# EAGLE design spinner (EAGLE 8.1.1)
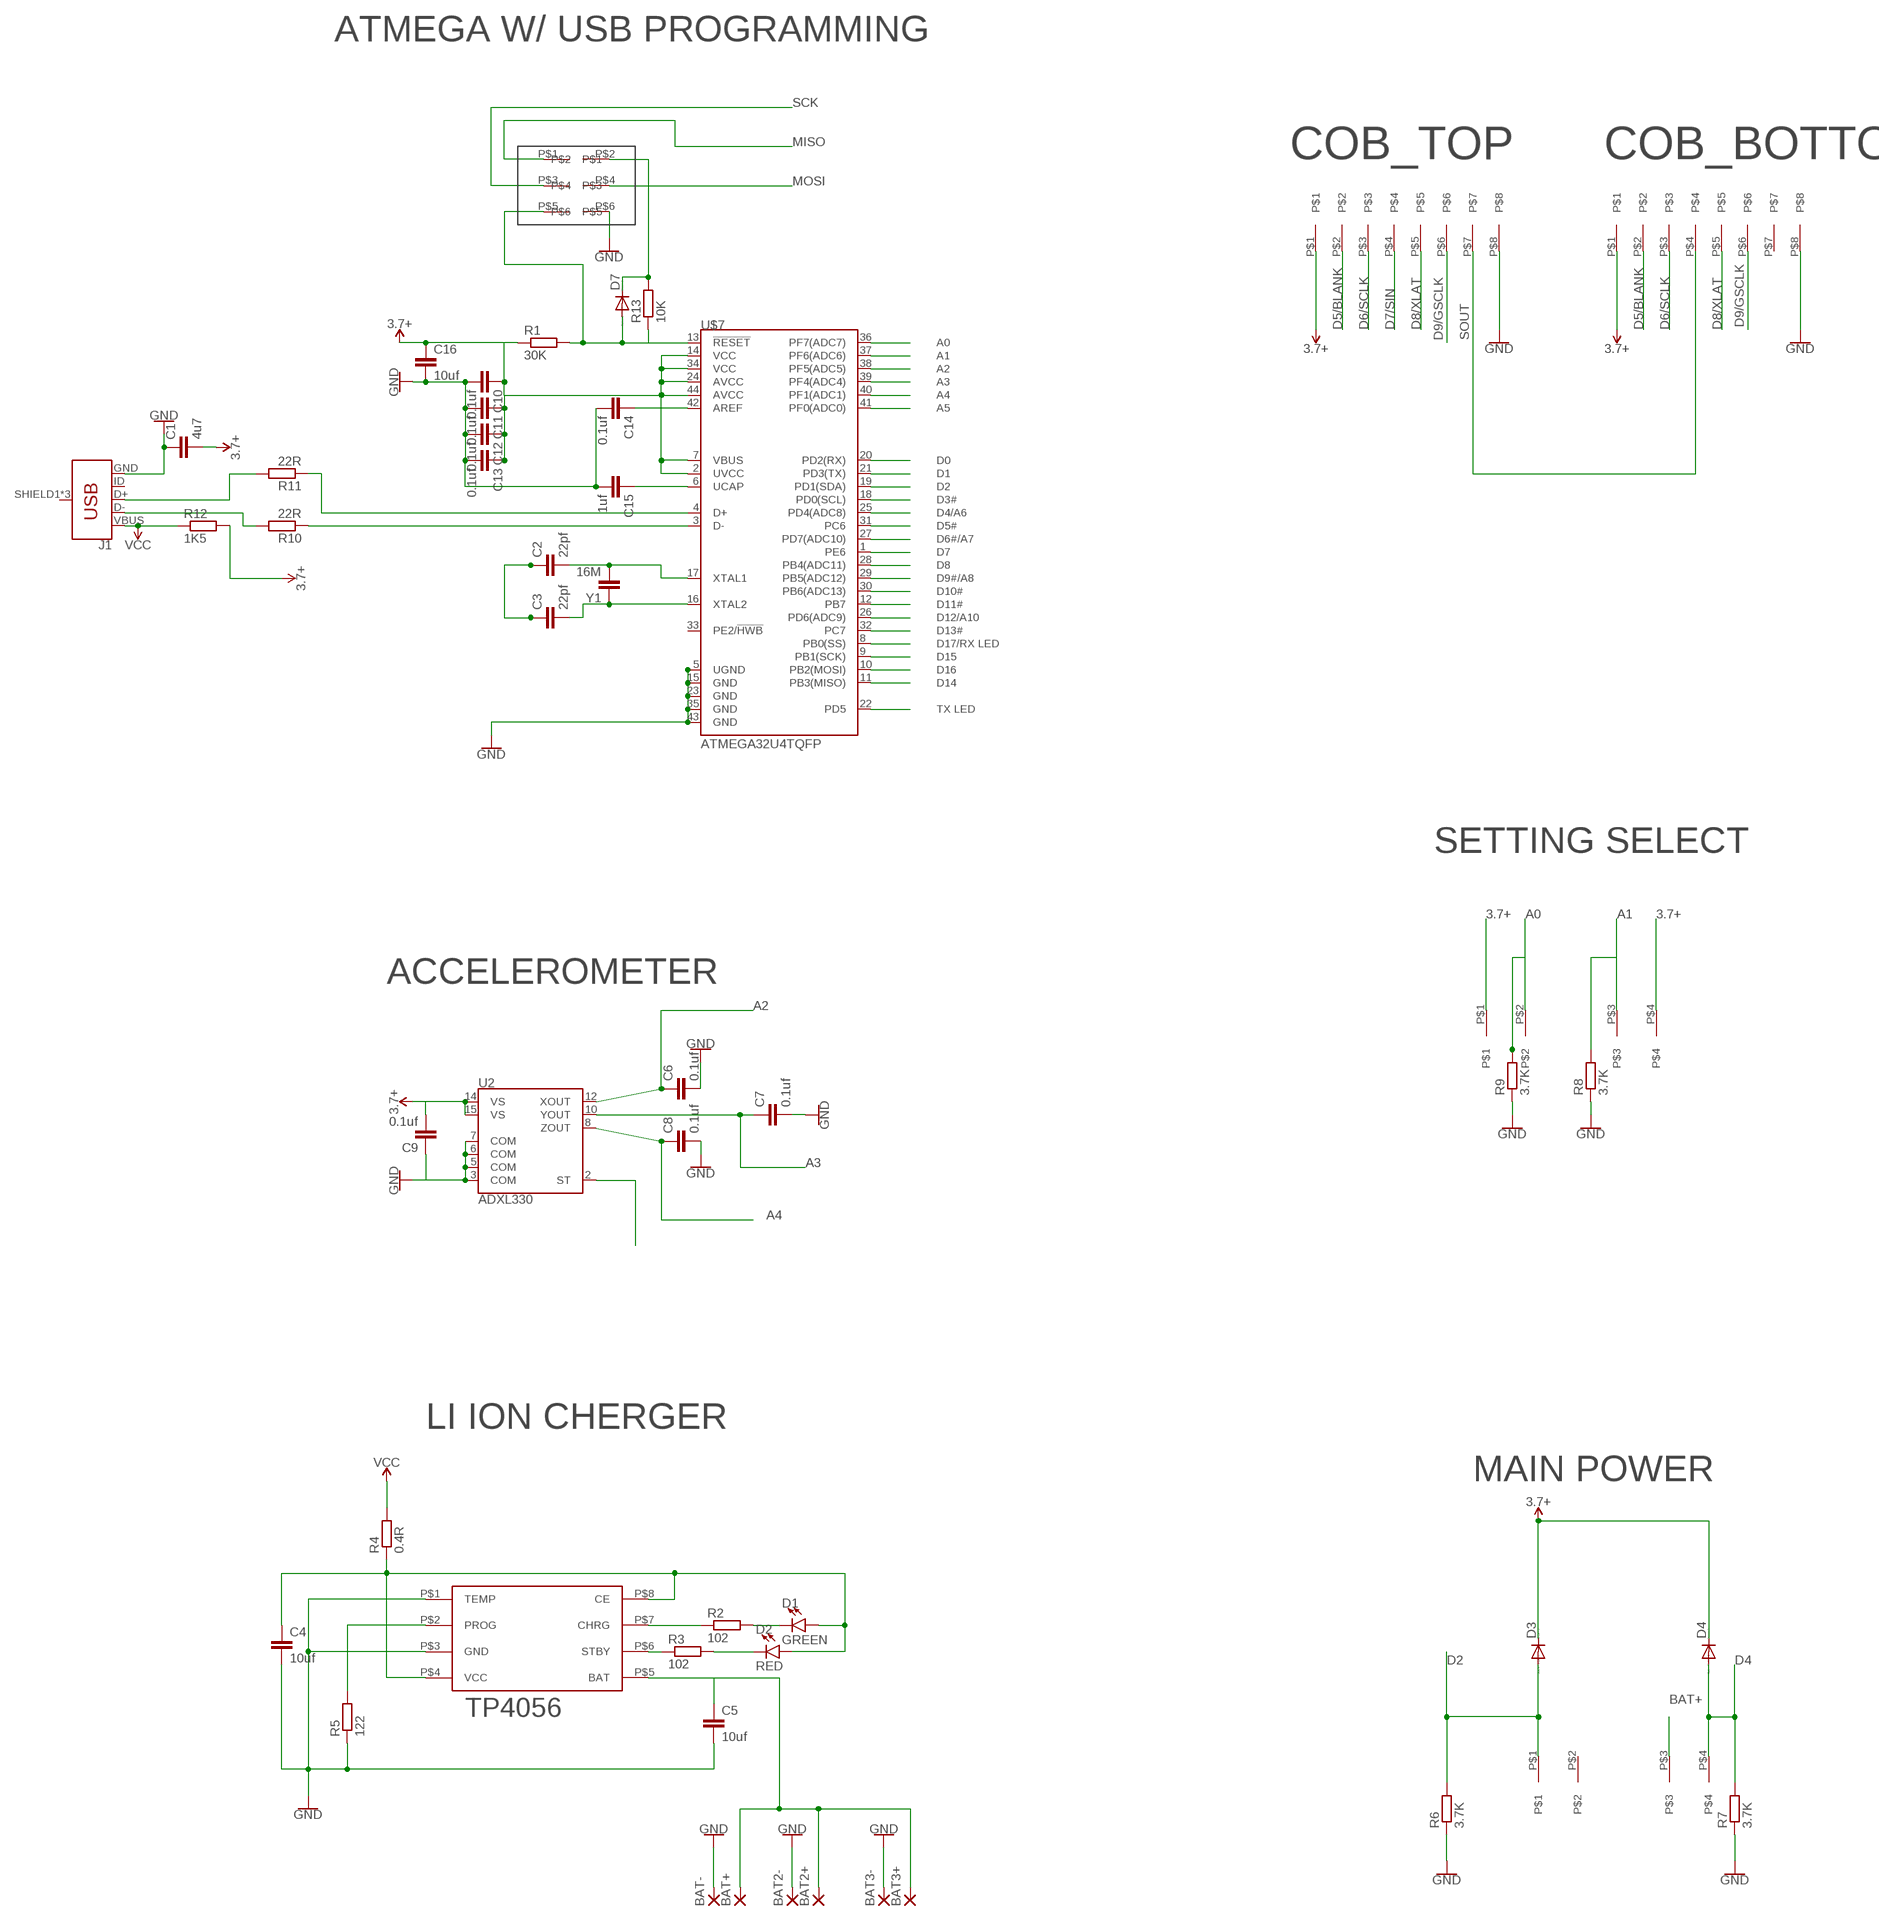
[diagram p0: schematic, sheet 1]

## Parts
BAT2+  SMD2  [SMD1,27-2,54]
BAT2-  SMD2  [SMD1,27-2,54]
BAT3+  SMD2  [SMD1,27-2,54]
BAT3-  SMD2  [SMD1,27-2,54]
BAT+  SMD2  [SMD1,27-2,54]
BAT-  SMD2  [SMD1,27-2,54]
C1  4u7  C-EUC0603  [C0603]
C2  22pf  C-EUC0603  [C0603]
C3  22pf  C-EUC0603  [C0603]
C4  10uf  C-EUC0603  [C0603]
C5  10uf  C-EUC0603  [C0603]
C6  0.1uf  C-EUC0603  [C0603]
C7  0.1uf  C-EUC0603  [C0603]
C8  0.1uf  C-EUC0603  [C0603]
C9  0.1uf  C-EUC0603  [C0603]
C10  0.1uf  C-EUC0603  [C0603]
C11  0.1uf  C-EUC0603  [C0603]
C12  0.1uf  C-EUC0603  [C0603]
C13  0.1uf  C-EUC0603  [C0603]
C14  0.1uf  C-EUC0603  [C0603]
C15  1uf  C-EUC0603  [C0603]
C16  10uf  C-EUC0603  [C0603]
D1  GREEN  LED-GREEN0603  [LED-0603]
D2  RED  LED-RED0603  [LED-0603]
D3  DIODE-SOD123  [SOD123]
D4  DIODE-SOD123  [SOD123]
D7  DIODE-SOD123  [SOD123]
J1  USB_MICRO-BREDUCED_PASTE  [USB-B-MICRO-SMD_RED_PASTE]
R1  30K  R-EU_R0603  [R0603]
R2  102  R-EU_R0603  [R0603]
R3  102  R-EU_R0603  [R0603]
R4  0.4R  R-EU_R0603  [R0603]
R5  122  R-EU_R0603  [R0603]
R6  3.7K  R-EU_R0603  [R0603]
R7  3.7K  R-EU_R0603  [R0603]
R8  3.7K  R-EU_R0603  [R0603]
R9  3.7K  R-EU_R0603  [R0603]
R10  22R  R-EU_R0603  [R0603]
R11  22R  R-EU_R0603  [R0603]
R12  1K5  R-EU_R0603  [R0603]
R13  10K  R-EU_R0603  [R0603]
U2  ADXL330  [LFCSP-16-4X4]
U$1  SLIDE_SWITCH  [SLIDE_SWITCH]
U$2  SLIDE_SWITCH  [SLIDE_SWITCH]
U$3  TP4056  [TP4056]
U$6  ICSP  [ICSP]
U$7  ATMEGA32U4TQFP  [SPARKFUN-DIGITALIC_TQFP44]
U$8  8PIN  [8PIN]
U$9  8PIN  [8PIN]
Y1  16M  C-EUC0603  [C0603]

## Nets
3.7+: C1.2 C9.2 C10.1 C11.1 C12.1 C13.1 C16.1 D3.C D4.C R1.1 R12.2 U2.14(VS) U2.15(VS) U$1.P$1 U$1.P$4 U$7.2(UVCC) U$7.7(VBUS) U$7.14(VCC) U$7.24(AVCC) U$7.34(VCC) U$7.44(AVCC) U$8.P$1 U$9.P$1
A0: R9.2 U$1.P$2 U$7.36(PF7(ADC7))
A1: R8.2 U$1.P$3 U$7.37(PF6(ADC6))
A2: C6.1 U2.12(XOUT) U$7.38(PF5(ADC5))
A3: C7.1 U2.10(YOUT) U$7.39(PF4(ADC4))
A4: C8.1 U2.8(ZOUT) U$7.40(PF1(ADC1))
A5: U$7.41(PF0(ADC0))
BAT+: BAT2+.1(P) BAT3+.1(P) BAT+.1(P) C5.1 U$2.P$3 U$3.P$5(BAT)
D0: U$7.20(PD2(RX))
D1: U$7.21(PD3(TX))
D2: D3.A R6.2 U$2.P$1 U$7.19(PD1(SDA))
D3: U$7.18(PD0(SCL))
D4: D4.A R7.2 U$2.P$4 U$7.25(PD4(ADC8))
D5/BLANK: U$7.31(PC6) U$8.P$2 U$9.P$2
D6/SCLK: U$7.27(PD7(ADC10)) U$8.P$3 U$9.P$3
D7/SIN: U$7.1(PE6) U$8.P$4
D8/XLAT: U$7.28(PB4(ADC11)) U$8.P$5 U$9.P$5
D9/GSCLK: R11.1 U$7.4(D+) U$7.29(PB5(ADC12)) U$8.P$6 U$9.P$6
D10: U$7.30(PB6(ADC13))
D11: U$7.12(PB7)
D12: U$7.26(PD6(ADC9))
D13: U$7.32(PC7)
D17: U$7.8(PB0(SS))
GND: BAT2-.1(P) BAT3-.1(P) BAT-.1(P) C1.1 C2.1 C3.1 C4.2 C5.2 C6.2 C7.2 C8.2 C9.1 C10.2 C11.2 C12.2 C13.2 C14.2 C15.2 C16.2 J1.GND R5.1 R6.1 R7.1 R8.1 R9.1 U2.3(COM) U2.5(COM) U2.6(COM) U2.7(COM) U$3.P$1(TEMP) U$3.P$3(GND) U$6.P$6 U$7.5(UGND) U$7.15(GND) U$7.23(GND) U$7.35(GND) U$7.43(GND) U$8.P$8 U$9.P$8
MISO: U$6.P$1 U$7.11(PB3(MISO))
MOSI: U$6.P$4 U$7.10(PB2(MOSI))
N$1: C2.2 U$7.17(XTAL1) Y1.2
N$2: C3.2 U$7.16(XTAL2) Y1.1
N$4: D7.C R13.2 U$6.P$2
N$5: R5.2 U$3.P$2(PROG)
N$6: C4.1 D1.A D2.A R4.1 U$3.P$4(VCC) U$3.P$8(CE)
N$8: U2.2(ST)
N$9: J1.D- R10.2
N$10: R2.1 U$3.P$7(CHRG)
N$11: R3.1 U$3.P$6(STBY)
N$12: D2.C R3.2
N$13: D1.C R2.2
N$14: J1.D+ R11.2
N$17: R10.1 U$7.3(D-)
N$40: U$7.22(PD5)
N$41: C14.1 U$7.42(AREF)
N$42: C15.1 U$7.6(UCAP)
RESET: D7.A R1.2 R13.1 U$6.P$5 U$7.13(!RESET)
SCK: U$6.P$3 U$7.9(PB1(SCK))
SOUT: U$8.P$7 U$9.P$4
VCC: J1.VBUS R4.2 R12.1
Unconnected: J1.ID J1.SHIELD1(SHIELD) J1.SHIELD2(SHIELD) J1.SHIELD3(SHIELD) U$2.P$2 U$7.33(PE2/!HWB) U$9.P$7

## Notes on the sheet
- ATMEGA W/ USB PROGRAMMING
- COB_TOP | COB_BOTTOM
- SETTING SELECT
- ACCELEROMETER
- LI ION CHERGER
- MAIN POWER

## Library data of the parts
BAT2+ BAT2- BAT3+ BAT3- BAT+ BAT- = wirepad:SMD2: SMD PAD
C1 C4-C16 = resistor:C-EU: CAPACITOR, European symbol
C2 C3 Y1 = rcl:C-EU: CAPACITOR, European symbol
D1 = SparkFun-LED:LED-GREEN: Green SMD LED Used in manufacturing of various products at SparkFun Packages: 0603 - SMD 0603 package [Product Link] <http://www.futureelectronics.com/en/technologies/semiconductors/optoelectronics/leds/Pages/9894312-LTST-C190GKT.aspx?CrossPart=HSMG-C190&IM=0> LilyPad 1206 - SMD1206 LilyPad package [Product Link] <http://www.futureelectronics.com/en/Technologies/Product.aspx?ProductID=IN150NGHARVATEKCORPORATION2049943&IM=0> 1206 - SMD1206 package [Product Link] <http://www.futureelectronics.com/en/technologies/semiconductors/optoelectronics/leds/Pages/8315665-LTST-C150KGKT.aspx?IM=0> 1206 Bottom Mount -SMD 1206 Bottom Mount [Product Link] <http://www.digikey.com/product-detail/en/lite-on-inc/LTST-C230KGKT/160-1456-1-ND/386854> SparkFun Products: Pro Mini 328 -5V <https://www.sparkfun.com/products/821> RedBoard <https://www.sparkfun.com/products/12757> MP3 Trigger <https://www.sparkfun.com/products/13720> Makey Makey <https://www.sparkfun.com/products/11076>; PROD_ID: DIO-00821
D2 = SparkFun-LED:LED-RED: Red SMD LED Used in manufacturing of most products at SparkFun Packages: 0603 - SMD 0603 package [Product Link] <http://docs.avagotech.com/docs/AV02-0551EN> 0603 SMART - SMD 0603 SMART package ( more efficient and expensive)[Product Link] <http://www.osram-os.com/Graphics/XPic2/00077099_0.pdf> 1206 - SMD1206 package [Product Link] <https://www.sparkfun.com/datasheets/DevTools/LilyPad/Q150OVS4.pdff> SparkFun Products: Pro Mini 328 -5V <https://www.sparkfun.com/products/821> RedBoard <https://www.sparkfun.com/products/12757> IOIO-OTG <https://www.sparkfun.com/products/13613>; PROD_ID: DIO-00819
D3 D4 D7 = diode:DIODE-: DIODE
J1 = SparkFun-Connectors:USB_MICRO-B: USB Type Micro-B Connector Male/female and PTH/SMT variants SparkFun Products: SparkFun microB USB Breakout <https://www.sparkfun.com/products/12035> SparkFun USB microB Plug Breakout <https://www.sparkfun.com/products/10031> SparkFun ESP8266 Thing <https://www.sparkfun.com/products/13231>; PROD_ID: CONN-11752
R1-R13 = resistor:R-EU_: RESISTOR, European symbol
U2 = SparkFun-Sensors:ADXL330: Analog Devices ADXL330 3-Axis Analog Accelerometer The ADXL330 is a small, thin, low power, complete 3-axis accelerometer with signal conditioned voltage outputs, all on a single monolithic IC. The product measures acceleration with a minimum full-scale range of ±3g. It can measure the static acceleration of gravity in tilt-sensing applications, as well as dynamic acceleration resulting from motion, shock, or vibration. Datasheet <https://www.sparkfun.com/datasheets/Components/ADXL330_0.pdf> SparkFun Products Triple Axis Accelerometer Breakout - ADXL330 <https://www.sparkfun.com/products/retired/692> (SEN-00692); PROD_ID: IC-08189
U$1 U$2 = spinner:SLIDE_SWITCH
U$3 = spinner:TP4056
U$6 = spinner:ICSP
U$7 = SparkFun-Retired:ATMEGA32U4: Atmel 44-pin 8-bit Microcontroller with 32KBytes of ISP Flash and USB Controller ----- Please use the QFN-44-NOPAD_1:1 package for the footprint of all boards using a 32U4. Route traces directly away from the pads as much as possible.; PROD_ID: IC-11161
U$8 U$9 = spinner:8PIN

## Board
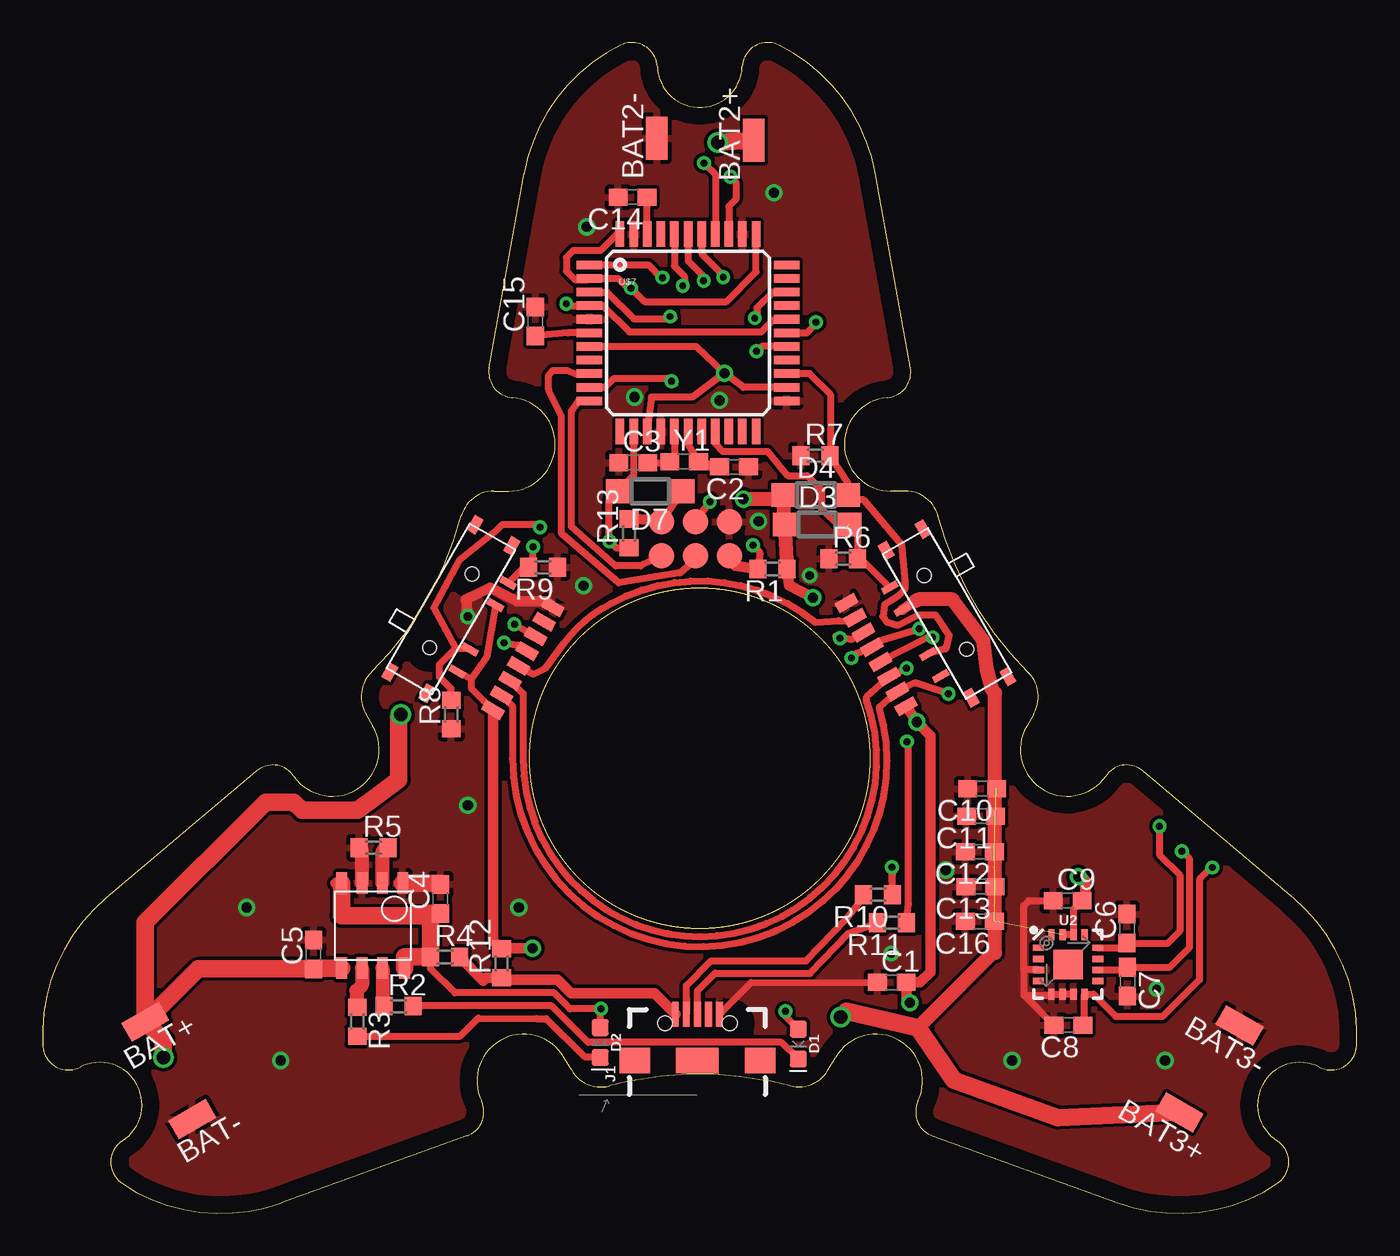
[diagram p1: board, top side]
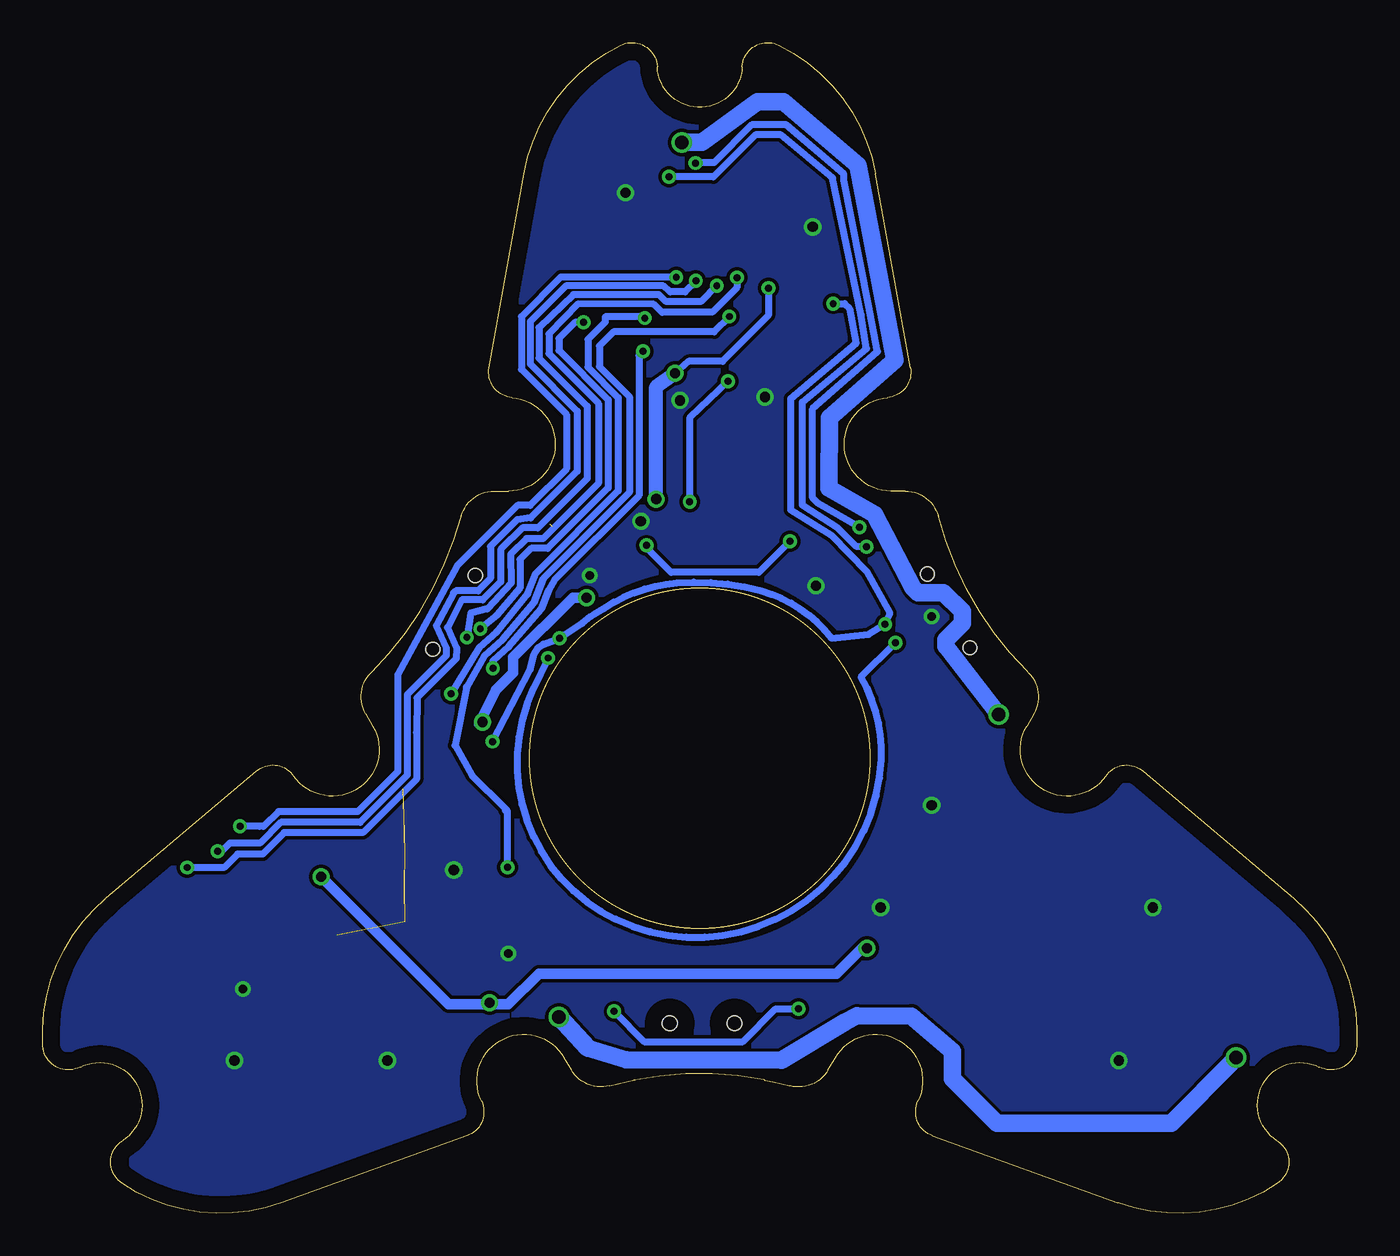
[diagram p2: board, bottom side, seen from below]

Size 77.28 x 68.81 mm. Coordinates in mm from the lower left corner, seen from the top.
Outline: 19.32,31.78 arc75 19,29.37 19.42,28.64 arc-175 14.78,25.7 arc96 12.57,25.99 3.72,18.52 arc53 0.02,9.83 arc114 2.2,8.59 arc-175 4.7,4.27 arc114 4.68,1.75 arc53 14.06,0.62 24.96,4.55 arc96 25.8,6.6 arc-175 30.67,9.15 31.09,8.42 arc75 33.34,7.49 arc-4 34.84,7.83
Outline: 24.62,40.96 arc-75 26.55,42.45 27.39,42.45 arc175 27.61,47.94 arc-96 26.26,49.7 28.31,61.1 arc-53 33.98,68.65 arc-114 36.14,67.38 arc175 41.14,67.38 arc-114 43.3,68.65 arc-53 48.98,61.1 51.02,49.7 arc-96 49.67,47.94 arc175 49.89,42.45 50.73,42.45 arc-75 52.66,40.96
Outline: 42.44,7.84 arc-4 43.94,7.49 arc75 46.19,8.43 46.61,9.15 arc-175 51.48,6.6 arc96 52.33,4.55 63.23,0.62 arc53 72.6,1.75 arc114 72.58,4.27 arc-175 75.08,8.59 arc114 77.27,9.83 arc53 73.56,18.52 64.71,25.99 arc96 62.51,25.7 arc-175 57.86,28.64 58.28,29.37 arc75 57.97,31.78
Outline: 19.31,31.78 19.35,31.82 arc30 24.62,40.99
Outline: 57.98,31.77 57.94,31.81 arc-30 52.65,41
Outline: 34.8,7.83 34.85,7.84 arc-23 42.54,7.82
Outline: circle at 38.64,26.75 radius 10
Copper layers (1*16): Top 0.035mm / dielectric 1.5mm / Bottom 0.035mm
Design rules "default": minimum track width 10mil, minimum drill 24mil, track to track 8mil, track to pad 8mil, pad to pad 8mil, via to via 8mil, smd to smd 8mil, copper to edge 40mil, drill to drill 8mil, minimum pad ring 10mil, minimum via ring 8mil, stop-mask expansion 4mil, vias tented up to drill 0mil, thermal gap 10mil

### Footprints (pad centres in the part's own frame; a part is rotated, then mirrored left to right if it is on the bottom)
SMD1,27-2,54 = smd 1.27 x 2.54: 1 0,0
C0603 = smd 1.1 x 1: 1 -0.85,0; 2 0.85,0
LED-0603 = smd 1 x 1: A -0.877,0; C 0.877,0
SOD123 = smd 1.4 x 1.4: A 1.9,0; C -1.9,0
USB-B-MICRO-SMD_RED_PASTE = smd 1.45 x 0.4: D+ 2.725,0; D- 2.725,0.65; GND 2.725,-1.3; ID 2.725,-0.65; VBUS 2.725,1.3 | smd 1.5 x 1.8: SHIELD1 0,3.685; SHIELD2 0,-3.685 | smd 1.5 x 2.5: SHIELD3 0,0 | hole 0.85: 2.2,1.9; 2.2,-1.9
R0603 = smd 1 x 1.1: 1 -0.85,0; 2 0.85,0
LFCSP-16-4X4 = smd 1.75 x 1.75: 0 0,0 | smd 0.65 x 0.37: 1 -1.75,0.975; 2 -1.75,0.325; 3 -1.75,-0.325; 4 -1.75,-0.975; 9 1.75,-0.975; 10 1.75,-0.325; 11 1.75,0.325; 12 1.75,0.975 | smd 0.37 x 0.65: 5 -0.975,-1.75; 6 -0.325,-1.75; 7 0.325,-1.75; 8 0.975,-1.75; 13 0.975,1.75; 14 0.325,1.75; 15 -0.325,1.75; 16 -0.975,1.75
SLIDE_SWITCH = smd 0.4 x 1: P$1 0,0; P$2 6,0; P$3 1.5,0; P$4 4.5,0 | smd 1 x 0.6: P$5 -2,0.9; P$6 -2,3.4; P$7 8,0.9; P$8 8,3.4 | hole 0.8: 0.4,2.1; 5.4,2.1
TP4056 = smd 0.635 x 1.27: P$1 0,0; P$2 1.2,0; P$3 2.4,0; P$4 3.6,0; P$5 3.6,5; P$6 2.4,5; P$7 1.2,5; P$8 -0.1,5
ICSP = smd 1.5 x 1.5: P$1 0,0; P$2 0,2; P$3 2,0; P$4 2,2; P$5 4,0; P$6 4,2
SPARKFUN-DIGITALIC_TQFP44 = smd 1.5 x 0.5: 1 -5.8,4; 2 -5.8,3.2; 3 -5.8,2.4; 4 -5.8,1.6; 5 -5.8,0.8; 6 -5.8,0; 7 -5.8,-0.8; 8 -5.8,-1.6; 9 -5.8,-2.4; 10 -5.8,-3.2; 11 -5.8,-4; 23 5.8,-4; 24 5.8,-3.2; 25 5.8,-2.4; 26 5.8,-1.6; 27 5.8,-0.8; 28 5.8,0; 29 5.8,0.8; 30 5.8,1.6; 31 5.8,2.4; 32 5.8,3.2; 33 5.8,4 | smd 0.5 x 1.5: 12 -4,-5.8; 13 -3.2,-5.8; 14 -2.4,-5.8; 15 -1.6,-5.8; 16 -0.8,-5.8; 17 0,-5.8; 18 0.8,-5.8; 19 1.6,-5.8; 20 2.4,-5.8; 21 3.2,-5.8; 22 4,-5.8; 34 4,5.8; 35 3.2,5.8; 36 2.4,5.8; 37 1.6,5.8; 38 0.8,5.8; 39 0,5.8; 40 -0.8,5.8; 41 -1.6,5.8; 42 -2.4,5.8; 43 -3.2,5.8; 44 -4,5.8
8PIN = smd 0.635 x 1.27: P$1 0,0; P$2 1,0; P$3 2,0; P$4 3,0; P$5 4,0; P$6 5,0; P$7 6,0; P$8 7,0

### Placement (x,y rotation side)
BAT2+  41.81,63.07 0 top
BAT2-  36.12,63.19 0 top
BAT3+  66.84,5.93 60 top
BAT3-  70.38,11.04 60 top
BAT+  6.04,11.26 120 top
BAT-  8.8,5.54 120 top
C1  49.93,13.57 0 top
C2  40.65,43.87 180 top
C3  34.73,44.13 0 top
C4  23.39,18.48 90 top
C5  15.93,15.22 90 top
C6  63.76,16.74 90 top
C7  63.79,13.62 270 top
C8  60.31,11.07 180 top
C9  60.27,18.38 0 top
C10  55.24,24.97 180 top
C11  55.18,23.35 180 top
C12  55.11,21.26 180 top
C13  55.14,19.21 180 top
C14  34.69,59.73 180 top
C15  28.97,52.42 90 top
C16  55.11,17.16 180 top
D1  44.43,9.95 270 top
D2  32.78,10.04 270 top
D3  45.53,40.49 0 top
D4  45.45,42.22 0 top
D7  35.72,42.44 180 top
J1  38.5,8.98 90 top
R1  42.92,37.87 180 top
R2  20.93,12.18 0 top
R3  18.51,11.27 270 top
R4  23.67,15.07 0 top
R5  19.46,21.49 0 top
R6  47.07,38.48 0 top
R7  45.44,44.53 0 top
R8  24.03,29.32 90 top
R9  29.42,37.97 180 top
R10  49.12,18.72 180 top
R11  49.94,17.08 180 top
R12  26.98,14.69 90 top
R13  34.48,39.96 90 top
U2  60.29,14.63 0 top
U$1  24.37,31.85 60 top
U$2  49.81,36.78 300 top
U$3  21.18,19.41 180 top
U$6  36.39,38.64 0 top
U$7  37.95,51.75 0 top
U$8  50.77,29.81 120 top
U$9  26.49,29.58 60 top
Y1  37.72,44.18 0 top

### Tracks (layer width: path | path; a pad name or v marks a point on that pad's centre or on a via)
3.7+  (via drill 0.4, 0.6)  (5 unrouted)
  Top 0.406: C9.2 60.62,17.87 U2.14 U2.15 | v40.1,49.38 38.2,47.98 35.8,47.98 35.6,46.48 U$7.14 | U$7.7 38.43,50.95 v40.1,49.38 | U$7.44 33.77,57.55 32.8,56.58 31.2,56.58 30.8,56.18 30.8,55.38 31.3,54.88 32.08,54.88 U$7.2 33.83,54.95 34.5,54.28 v34.6,54.38 35.4,53.58 40.2,53.58 41.95,55.33 U$7.34 | U$7.24 41.2,48.55 v40.1,49.38 | U$9.P$1 25.2,30.87 25.2,31.38 | 25.2,31.38 U$1.P$1 | U$1.P$4 26.1,32.68 25.2,31.38
  Top 0.61: R1.1 43.87,36.91 v45.3,36.18 | U$8.P$1 v51.4,28.88 52.2,28.08 52.2,14.18 51.59,13.57 C1.2 50.78,12.6 v51,12.38 | C9.2 61.3,18.56 61.3,19.58 61.1,19.78 v60.9,19.78 | v28.8,15.58 27.02,15.58 R12.2 26.49,16.03 U$9.P$1
  Top 0.813: R1.1 D3.C D4.C 43.2,41.98 v41.2,41.98
  Bottom 0.406: v34.6,54.38 34.6,52.78 37.3,50.08 39.3,50.08 v40.1,49.38
  Bottom 0.61: v45.3,36.18 46.1,36.18 49.6,32.68 49.6,31.78 50.6,30.78 51.6,28.78 v51.4,28.88 | v60.9,19.78 53.4,12.28 51.1,12.28 | 51.1,12.28 v51,12.38 | 51.1,12.28 49.9,12.28 48.1,14.08 30.6,14.08 29.1,15.58 v28.8,15.58
  Bottom 0.813: v41.2,41.98 41.2,48.58 v40.1,49.38
A0  (via drill 0.41)
  Top 0.406: U$1.P$2 28.3,37.97 R9.2 28.84,38.24 v28.84,39.18 | v40.45,60.92 40.76,60.61 40.76,59.6 40.35,59.19 U$7.36
  Bottom 0.406: v28.84,39.18 29.42,39.18 30.55,40.31 32.52,41.56 32.6,41.64 32.6,47.68 28.83,50.82 29.16,52.84 30.83,60.86 33.85,63.38 35.37,63.38 37.83,60.92 v40.45,60.92
A1  (via drill 0.41)
  Top 0.406: R8.2 24.03,30.82 23.34,31.51 23.34,32.27 24.27,33.2 | 24.27,33.2 25.07,33.2 U$1.P$3 | v29.25,40.33 29.25,40.39 29.35,40.49 27.04,40.49 26.69,40.14 24.5,38.38 23,35.58 24.27,33.2 | v38.89,61.73 39.55,61.07 U$7.37
  Bottom 0.406: v29.25,40.33 31.69,41.74 32,42.05 32,47.28 28.19,50.65 28.72,53.42 30.17,60.72 30.17,61.1 33.53,63.97 35.59,63.97 37.8,61.76 39.05,61.76 39.02,61.73 v38.89,61.73
A2  (via drill 0.41)
  Top 0.406: U2.12 63.48,15.6 C6.1 66.16,15.89 66.85,16.58 66.85,19.91 65.67,21.09 v65.67,22.75 | U$7.38 38.75,56.4 40.07,55.09 40.07,55.07 v40.02,55.02
  Bottom 0.406: v40.02,55.02 46.81,55.02 49.12,52.71 49.12,49.61 46.47,46.96 46.47,43.74 48.6,41.61 49.36,41.61 52.9,38.07 56.39,31.66 56.39,25.96 58.74,23.61 63.4,23.61 64.29,22.74 64.53,22.75 v65.67,22.75
A3  (via drill 0.41)
  Top 0.406: U2.10 63.71,14.3 C7.1 66.28,14.47 67.41,15.6 67.41,20.86 v66.99,21.28 | U$7.39 37.95,55.98 38.82,55.11 38.82,54.86 v38.87,54.81
  Bottom 0.406: v38.87,54.81 38.87,54.78 39.49,54.16 40.38,54.16 40.77,54.51 46.51,54.51 48.61,52.41 48.61,49.92 45.84,47.15 45.84,43.61 48.58,40.87 49.37,40.77 50.94,39.2 50.94,37.32 51.67,36.59 52.98,36.59 53.12,36.45 54.13,34.54 53.54,33.24 53.54,32.78 55.83,30.49 55.83,25.75 58.6,22.98 63.27,22.98 64.49,21.76 66.27,21.76 66.8,21.23 66.94,21.23 v66.99,21.28
A4  (via drill 0.41)
  Top 0.406: C8.1 61.27,11.13 U2.8 61.8,12.88 63.1,11.58 65.86,11.58 68.01,13.73 68.01,19.63 68.71,20.33 v68.77,20.33 | U$7.40 37.15,55.67 37.73,55.09 37.73,54.6 v37.64,54.51
  Bottom 0.406: v37.64,54.51 38.57,53.58 40.61,53.58 41.04,53.99 46.07,53.99 48.09,52.06 48.09,50.27 45.26,47.44 45.26,43.18 48.15,40.29 49.07,40.29 50.34,39.02 50.34,37.11 51.4,36.05 52.63,36.05 53.47,34.43 52.93,33.22 52.95,32.61 55.27,30.29 55.29,28.26 55.29,25.51 58.43,22.37 63.08,22.37 64.33,21.12 65.81,21.12 66.61,20.32 v68.76,20.32 v68.77,20.33
BAT+  (via drill 0.8 pad 1.02)
  Top 0.61: 51.3,35.98 U$2.P$3
  Top 0.813: 51.46,10.91 55.85,15.3 56,15.3 56,30.59 55.85,30.74 55.51,31.98 55.3,33.68 53.5,36.08 51.5,36.08 51.3,35.98
  Top 1.016: U$3.P$5 15.93,14.41 C5.1 9.15,14.37 BAT+.1 | BAT+.1 6.04,17.1 13.11,24.17 14.76,24.17 15.25,23.68 18.53,23.68 20.94,25.49 20.94,29.12 v21.06,29.31 | v39.7,62.94 BAT2+.1 | BAT3+.1 59.68,5.62 53.59,7.81 51.46,10.91 47.27,11.89 v46.92,11.55 | v7.1,9.16 7.1,10.2 BAT+.1
  Bottom 1.016: v21.06,29.31 24.17,33.33 24.17,33.71 23.2,34.68 23.2,35.38 24.3,36.48 25.8,36.48 26.1,36.78 28.37,41.08 31.03,42.62 31.02,46.75 27.16,50.14 29.34,61.61 33.71,65.33 35.25,65.33 38.5,62.94 v39.7,62.94 | v46.92,11.55 45.2,9.71 42.96,9.04 33.83,9.01 30.07,11.27 29.39,11.61 26.19,11.59 23.77,9.52 23.77,7.91 21.16,5.3 10.92,5.3 7.23,8.99 7.23,9.03 v7.1,9.16
D2  (1 unrouted)
  Top 0.406: U$7.19 39.54,45.25 39.98,44.78 42.62,44.78 43.8,43.36 44.96,43.36 45.79,42.53 45.79,41.42 46.87,40.34 47.28,40.34 | U$2.P$1 47.99,38.6 R6.2 47.92,40 D3.A
D4
  Top 0.406: U$7.25 45.09,49.35 46.31,48.13 46.31,44.55 R7.2 47.35,42.91 D4.A 47.64,41.93 48.29,41.93 50.5,39.32 50.7,37.08 50.7,36.68 50.3,36.28 49.5,35.78 49.4,35.08 49.6,34.78 50.3,34.58 51.5,35.18 52.5,35.18 53.3,33.98 53.1,33.18 U$2.P$4
D5/BLANK  (via drill 0.41)
  Top 0.406: U$9.P$2 27.63,29.8 27.63,26.72 arc131 45.89,18.36 arc66 49.2,29.7 49.2,29.74 U$8.P$2 51.28,31.18 v53.26,30.54 | U$7.31 42.93,54.15 42,53.22 42,52.58 42.03,52.55 41.94,52.55 v41.87,52.62
  Bottom 0.406: v41.87,52.62 41.94,52.69 44.2,52.69 44.2,52.38 45.21,51.37 45.21,49.73 43.43,47.95 43.43,42.46 48.29,37.6 48.75,36.41 50.59,34.16 51.6,33.24 v53.26,30.54
D6/SCLK  (via drill 0.41)
  Top 0.406: U$9.P$3 28.25,30.55 28.25,26.68 arc90 38.66,16.27 arc110 48.44,30.16 48.44,30.35 U$8.P$3 v50.8,32.04 | U$7.27 42.29,50.95 42,50.66 v41.97,50.66
  Bottom 0.406: v41.97,50.66 42.22,50.41 42.22,42.19 47.16,37.25 | 47.16,37.25 47.17,37.25 | 47.16,37.25 47.54,36.62 47.97,35.5 49.87,33.29 50.79,32.47 50.78,32.08 v50.8,32.04
D7/SIN  (via drill 0.41)
  Top 0.406: U$7.1 35.62,55.75 36.37,55 v36.45,55 | v52.33,33.85 52.03,33.83 U$8.P$4
  Bottom 0.406: v36.45,55 36.45,54.41 37.89,52.97 40.85,52.95 41.33,53.42 45.79,53.45 47.51,51.69 47.51,50.53 44.59,47.61 44.59,42.91 47.84,39.66 48.83,39.66 49.75,38.74 49.73,37.04 51.12,35.53 52.1,35.28 v52.33,33.85
D8/XLAT  (via drill 0.41)
  Top 0.406: v47.56,32.64 47.46,32.74 47.62,32.81 48.36,33.05 U$8.P$5 49.37,33.7 v51.54,34.35 | v27.14,33.54 27.96,33.39 U$9.P$5 | U$7.28 44.93,51.75 45.51,52.33 v45.47,52.37
  Bottom 0.406: v47.56,32.64 48.4,30.87 arc-90 43.58,17.29 arc-113 27.96,26.67 arc-33 29.16,31.53 27.17,33.52 27.17,33.54 v27.14,33.54 | v45.47,52.37 45.97,52.37 46.92,51.42 46.92,50.72 44.03,47.83 44.03,42.64 47.58,39.09 48.55,39.09 49.21,38.43 49.21,36.74 50.56,35.16 v51.54,34.35
D9/GSCLK  (via drill 0.41)
  Top 0.406: U$8.P$6 47.55,33.72 46.66,33.89 46.64,33.92 v46.89,33.8 | v27.74,34.62 U$9.P$6 | 43.73,52.57 U$7.29 43.72,52.52 42.97,52.52 42.26,51.81 34.5,51.81 32.96,53.35 U$7.4 30.91,53.35 v30.79,53.47 | R11.1 50.91,18.18 50.91,27.63 v50.81,27.73
  Bottom 0.406: v30.79,53.47 30.12,53.47 29.84,53.19 29.45,51.14 33.3,47.89 33.3,41.35 30.88,39.85 28.85,37.75 27.46,35.28 v27.74,34.62 27.72,34.64 27.71,34.64 28.71,34.03 30.9,33.81 arc-37 35.02,36.58 arc-20 39.98,37.05 arc-24 43.69,35.92 arc-4 43.97,35.75 arc3 44.86,35.2 arc-15 45.55,34.67 46.63,33.98 v46.89,33.8 47.83,33.46 48.14,33.25 48.39,32.85 48.61,31.96 v50.81,27.73
GND  (via drill 0.5, 0.6, 0.6 pad 1.02)
  Top 0.406: J1.GND 41.66,13.56 C1.1 | U2.7 U2.6 U2.5 59.32,12.83 57.72,12.83 | U2.3 57.72,14.3 | 57.72,12.83 57.72,14.3 | 57.72,14.3 57.69,14.3 57.69,18.09 57.98,18.38 C9.1 | C8.2 57.72,12.81 57.72,12.83
  Top 0.61: U$9.P$8 29.66,35.98 27.9,35.98 26.3,36.78 24.9,36.08 v25,35.08
  Top 0.813: U$3.P$3 18.78,21.32 R5.1
  Top 1.016: U$3.P$1 23.39,19.41 C4.2
  other vias: 12,17.98 14,8.98 32,57.98 43,59.98 25,23.98 28,17.98 53.1,20.18 57,8.98 66,8.98 31.8,36.88 34.8,47.98 39.8,47.78 42.1,40.68 45.1,37.48 49.9,15.28 65.5,13.18
  pour Top: 0,-0.02 0,68.98 78,68.98 78,-0.02
  pour Bottom: -2,-2.02 -2,69.98 84,69.98 84,-2.02
MISO
  Top 0.406: U$6.P$1 35.17,38.06 33.69,38.06 31.1,40.36 31.1,47.15 31.55,47.8 U$7.11
MOSI  (via drill 0.41)
  Top 0.406: 36.89,48.95 36.91,48.93 37.16,48.73 v36.98,48.91 36.71,49.08 33.6,49.08 33.07,48.55 U$7.10 | U$6.P$4 v39.23,41.82
  Bottom 0.406: v36.98,48.91 39.23,46.76 v39.23,41.82
N$1
  Top 0.406: U$7.17 37.97,45.18 Y1.2
  Top 0.61: C2.2 39.38,43.87 Y1.2
N$2
  Top 0.406: U$7.16 37.15,44.37 Y1.1 37.02,44.13 C3.2
N$4
  Top 0.406: U$6.P$2 D7.C
  Top 0.61: U$6.P$2 35.87,40.76 R13.2
N$5
  Top 0.813: U$3.P$2 19.98,21.16 arc-90 R5.2
N$6  (via drill 0.41)
  Top 0.406: D1.A 43.73,11.52 43.73,11.85 43.71,11.87 v43.67,11.87 | D2.A 32.78,11.97 v32.83,12.02 31,12.02 30.06,12.96 24.24,12.96 22.81,14.39 R4.1
  Top 0.61: 17.24,19.41 U$3.P$4
  Top 1.016: C4.1 22.82,17.63 22.82,17.48 | 22.82,17.48 R4.1 21.28,15.07 U$3.P$8 | U$3.P$4 17.57,17.48 22.82,17.48
  Bottom 0.406: v43.67,11.87 41.9,10.1 36.1,10.1 34.18,12.02 v32.83,12.02
N$9
  Top 0.406: 37.85,12.66 J1.D- 37.85,13.39 39.3,14.84 44.89,14.84 47.27,17.32 48.07,18.32 R10.2
N$10
  Top 0.813: U$3.P$7 19.98,12.16 R2.1
N$11
  Top 0.813: U$3.P$6 18.78,13.41 18.46,13.09 18.46,12.17 R3.1
N$12
  Top 0.406: R3.2 24.55,10.42 25.61,11.48 29.04,11.45 29.61,11.45 31.85,9.21 32.74,9.21 D2.C
N$13
  Top 0.406: D1.C 43.46,10.05 32.07,10.05 29.93,12.19 22.29,12.19 22.28,12.18 R2.2
N$14
  Top 0.406: J1.D+ 38.5,13.08 39.54,14.12 45.13,14.11 47.38,16.46 R11.2
N$17  (via drill 0.41)
  Top 0.406: U$7.3 33.19,54.15 34.77,52.57 37.09,52.57 37.13,52.61 36.98,52.61 36.9,52.69 v36.9,52.71 | R10.1 49.97,20.22 49.94,19.49 v49.94,20.34
  Bottom 0.406: v36.9,52.71 37.8,51.81 43.71,51.81 44.54,50.98 44.54,49.77 42.77,48 42.77,42.37 47.85,37.29 48.42,35.85 50.24,33.71 51.31,32.75 52.36,30.93 53.03,27.5 52.01,25.73 50.08,23.8 | 50.08,23.8 50.08,23.67 | v49.94,20.34 49.94,23.66 50.08,23.8
N$41
  Top 0.406: U$7.42 35.55,59.7 C14.1
N$42
  Top 0.406: U$7.6 30.89,51.75 C15.1
RESET  (via drill 0.41)
  Top 0.406: v41.77,39.26 42.17,38.86 R1.2 | R13.1 33.72,39.11 v33.33,39.5 33.33,39.56 33.28,39.61 33.28,41.9 D7.A 34.75,43.37 U$7.13
  Top 0.61: U$6.P$5 40.75,38.07 R1.2
  Bottom 0.406: v33.33,39.5 35.16,37.67 40.32,37.67 41.85,39.2 41.85,39.37 41.77,39.29 v41.77,39.26
SCK
  Top 0.406: U$6.P$3 38.31,38.37 37.47,37.64 33.88,37.06 30.5,39.98 30.5,46.86 29.75,48.41 29.76,49.27 30,49.54 30.04,49.53 30.03,49.55 30.86,49.55 31.31,49.34 31.55,49.34 31.56,49.35 U$7.9
SOUT
  Top 0.406: U$9.P$4 28.84,31.69 29.59,32.06 30.67,33.51 arc-26 33.4,35.84 arc-68 45.45,34.74 46.82,34.84 47.31,34.79 47.62,34.95 U$8.P$7
VCC
  Top 0.61: R4.2 25.91,13.68 26.07,13.84 R12.1 27.1,13.72 30.27,13.72 31.06,12.93 35.98,12.93 J1.VBUS